# EAGLE schematic motor_driver (EAGLE 7.3.0)
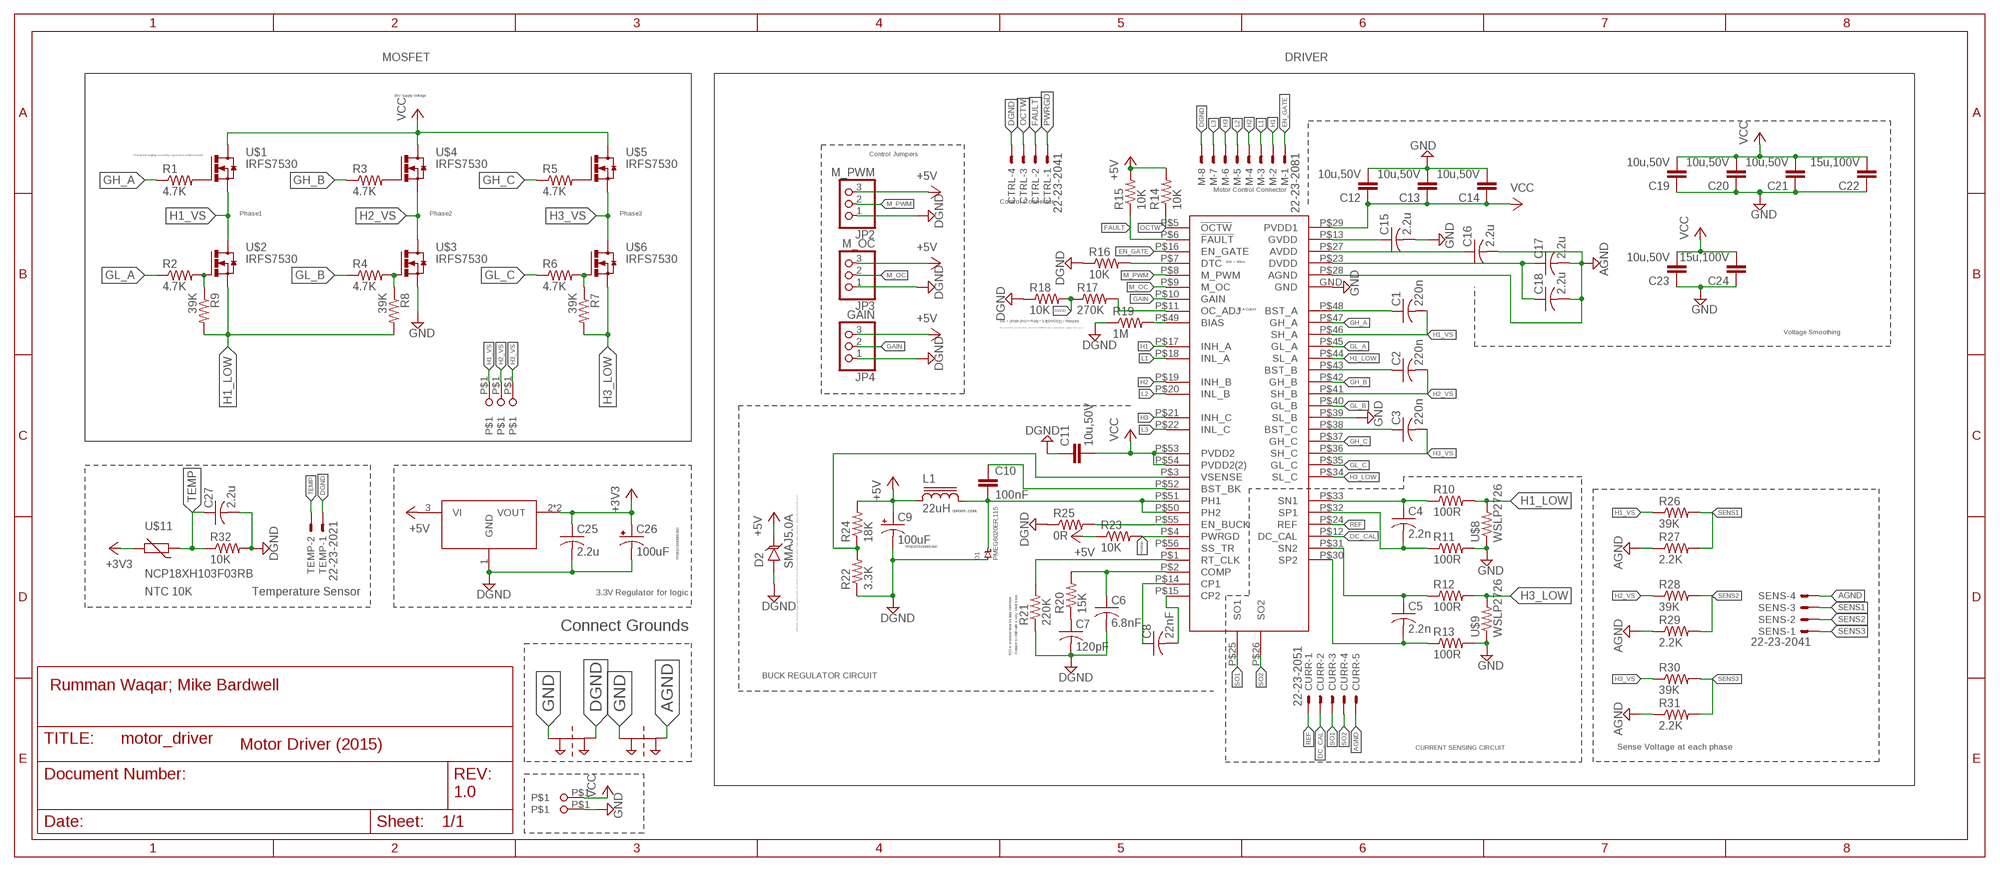
[diagram p0: schematic, sheet 1]

## Parts
C1  220n  C-USC0805  [C0805]
C2  220n  C-USC0805  [C0805]
C3  220n  C-USC0805  [C0805]
C4  2.2n  C-USC0603  [C0603]
C5  2.2n  C-USC0603  [C0603]
C6  6.8nF  C-USC0603  [C0603]
C7  120pF  C-USC0603  [C0603]
C8  22nF  C-USC0603  [C0603]
C9  100uF  CAP_POL3528-KIT  [EIA3528-KIT]
C10  100nF  CAP0805  [0805]
C11  10u,50V  CAP1206  [1206]
C12  10u,50V  CAP1206  [1206]
C13  10u,50V  CAP1206  [1206]
C14  10u,50V  CAP1206  [1206]
C15  2.2u  C-USC0805  [C0805]
C16  2.2u  C-USC0805  [C0805]
C17  2.2u  C-USC0805  [C0805]
C18  2.2u  C-USC0805  [C0805]
C19  10u,50V  CAP1206  [1206]
C20  10u,50V  CAP1206  [1206]
C21  10u,50V  CAP1206  [1206]
C22  15u,100V  C-EUC2220K  [C2220K]
C23  10u,50V  CAP1206  [1206]
C24  15u,100V  C-EUC2220K  [C2220K]
C25  2.2u  C-USC0805  [C0805]
C26  100uF  CAP_POL3528-KIT  [EIA3528-KIT]
C27  2.2u  C-USC0805  [C0805]
CTRL  22-23-2041  [22-23-2041]
CURR  22-23-2051  [22-23-2051]
D1  PMEG6020ER,115  DIODE[SCHOTKY]-SOD123W  [SOD123W]
D2  SMAJ5.0A  TVSSMA  [SMA-DIODE]
JP2  M_PWM  PINHD-1X3  [1X03]
JP3  M_OC  PINHD-1X3  [1X03]
JP4  GAIN  PINHD-1X3  [1X03]
L1  22uH  SDR0805  [SDR0805]
M  22-23-2081  [22-23-2081]
PT1  2PT_GND_TIE  [2PT_GND_TIE]
PT2  2PT_GND_TIE  [2PT_GND_TIE]
R1  4.7K  R-US_R0603  [R0603]
R2  4.7K  R-US_R0603  [R0603]
R3  4.7K  R-US_R0603  [R0603]
R4  4.7K  R-US_R0603  [R0603]
R5  4.7K  R-US_R0603  [R0603]
R6  4.7K  R-US_R0603  [R0603]
R7  39K  R-US_R0603  [R0603]
R8  39K  R-US_R0603  [R0603]
R9  39K  R-US_R0603  [R0603]
R10  100R  R-US_R0603  [R0603]
R11  100R  R-US_R0603  [R0603]
R12  100R  R-US_R0603  [R0603]
R13  100R  R-US_R0603  [R0603]
R14  10K  R-US_R0603  [R0603]
R15  10K  R-US_R0603  [R0603]
R16  10K  R-US_R0603  [R0603]
R17  270K  R-US_R0603  [R0603]
R18  10K  R-US_R0603  [R0603]
R19  1M  R-US_R0603  [R0603]
R20  15K  R-US_R0603  [R0603]
R21  220K  R-US_R0603  [R0603]
R22  3.3K  R-US_R0603  [R0603]
R23  10K  R-US_R0603  [R0603]
R24  18K  R-US_R0603  [R0603]
R25  0R  R-US_R0603  [R0603]
R26  39K  R-US_R0805  [R0805]
R27  2.2K  R-US_R0805  [R0805]
R28  39K  R-US_R0805  [R0805]
R29  2.2K  R-US_R0805  [R0805]
R30  39K  R-US_R0805  [R0805]
R31  2.2K  R-US_R0805  [R0805]
R32  10K  R-US_M0805  [M0805]
SENS  22-23-2041  [22-23-2041]
TEMP  22-23-2021  [22-23-2021]
U$1  IRFS7530  IRFS7530_HEATSINK  [IRF7530_HEATSINK]
U$2  IRFS7530  IRFS7530_HEATSINK  [IRF7530_HEATSINK]
U$3  IRFS7530  IRFS7530_HEATSINK  [IRF7530_HEATSINK]
U$4  IRFS7530  IRFS7530_HEATSINK  [IRF7530_HEATSINK]
U$5  IRFS7530  IRFS7530_HEATSINK  [IRF7530_HEATSINK]
U$6  IRFS7530  IRFS7530_HEATSINK  [IRF7530_HEATSINK]
U$7  DRV8302  [DRV8302]
U$8  WSLP2726  [WSLP2726]
U$9  WSLP2726  [WSLP2726]
U$10  TC2117  [SOT223]
U$11  NCP18XH103F03RB  [R0603]
U$12  1CONN_SOLDER  [1CONN_PAD]
U$13  1CONN_SOLDER  [1CONN_PAD]
U$14  1CONN_SOLDER  [1CONN_PAD]
U$15  1CONN_SOLDER  [1CONN_PAD]
U$16  1CONN_SOLDER  [1CONN_PAD]

## Nets
+3V3: C25.1 C26.A(+) U$10.2(VOUT) U$10.4(VOUT) U$11.2
+5V: C9.A(+) D2.C JP2.3 JP3.3 JP4.3 L1.1 R14.2 R15.2 R23.1 R24.2 U$10.3(VI)
AGND: C16.2 C17.2 C18.2 CURR.5 PT2.P$2 R27.1 R29.1 R31.1 SENS.4 U$7.P$28(AGND)
DC_CAL: CURR.2 U$7.P$12(DC_CAL)
DGND: C6.2 C7.2 C9.C(-) C11.1 C25.2 C26.C(-) C27.2 CTRL.4 D1.P$1 D2.A JP2.1 JP3.1 JP4.1 M.8 PT1.P$2 R16.1 R18.1 R19.1 R21.1 R22.1 R25.1 R32.2 TEMP.1 U$10.1(GND)
DVDD: R17.1 R18.2
EN_GATE: M.1 U$7.P$16(EN_GATE)
FAULT: CTRL.2 R15.1 U$7.P$6(!FAULT)
GAIN: JP4.2 U$7.P$10(GAIN)
GH_A: R1.1 U$7.P$47(GH_A)
GH_B: R3.1 U$7.P$42(GH_B)
GH_C: R5.1 U$7.P$37(GH_C)
GL_A: R2.1 U$7.P$45(GL_A)
GL_B: R4.1 U$7.P$40(GL_B)
GL_C: R6.1 U$7.P$35(GL_C)
GND: C12.2 C13.2 C14.2 C15.2 C19.1 C20.1 C21.1 C22.1 C23.1 C24.1 PT1.P$1 PT2.P$1 R11.2 R13.2 U$3.S1(S) U$3.S2(S) U$3.S3(S) U$3.S4(S) U$3.S5(S) U$7.GND U$7.P$39(SL_B) U$8.P$1@1 U$8.P$1@2 U$9.P$1@1 U$9.P$1@2 U$16.P$1
H1: M.2 U$7.P$17(INH_A)
H1_LOW: R8.2 R9.2 R10.2 U$2.S1(S) U$2.S2(S) U$2.S3(S) U$2.S4(S) U$2.S5(S) U$7.P$44(SL_A) U$8.P$2@1 U$8.P$2@2
H1_VS: C1.2 R26.1 U$1.S1(S) U$1.S2(S) U$1.S3(S) U$1.S4(S) U$1.S5(S) U$2.D1(D) U$7.P$46(SH_A) U$14.P$1
H2: M.4 U$7.P$19(INH_B)
H2_VS: C2.2 R28.1 U$3.D1(D) U$4.S1(S) U$4.S2(S) U$4.S3(S) U$4.S4(S) U$4.S5(S) U$7.P$41(SH_B) U$13.P$1
H3: M.6 U$7.P$21(INH_C)
H3_LOW: R7.2 R12.2 U$6.S1(S) U$6.S2(S) U$6.S3(S) U$6.S4(S) U$6.S5(S) U$7.P$34(SL_C) U$9.P$2@1 U$9.P$2@2
H3_VS: C3.2 R30.1 U$5.S1(S) U$5.S2(S) U$5.S3(S) U$5.S4(S) U$5.S5(S) U$6.D1(D) U$7.P$36(SH_C) U$12.P$1
L1: M.3 U$7.P$18(INL_A)
L2: M.5 U$7.P$20(INL_B)
L3: M.7 U$7.P$22(INL_C)
M_OC: JP3.2 U$7.P$9(M_OC)
M_PWM: JP2.2 U$7.P$8(M_PWM)
N$1: R1.2 U$1.G1(G)
N$2: R2.2 R9.1 U$2.G1(G)
N$3: R4.2 R8.1 U$3.G1(G)
N$4: R3.2 U$4.G1(G)
N$5: R5.2 U$5.G1(G)
N$6: R6.2 R7.1 U$6.G1(G)
N$7: C1.1 U$7.P$48(BST_A)
N$8: R17.2 U$7.P$11(OC_ADJ)
N$10: C8.1 U$7.P$14(CP1)
N$11: C5.2 R13.1 U$7.P$30(SP2)
N$12: C2.1 U$7.P$43(BST_B)
N$13: C8.2 U$7.P$15(CP2)
N$14: C7.1 R20.1
N$15: R21.2 U$7.P$1(RT_CLK)
N$16: R16.2 U$7.P$7(DTC)
N$17: R25.2 U$7.P$55(EN_BUCK)
N$18: C15.1 U$7.P$13(GVDD)
N$19: C10.2 D1.P$2 L1.2 U$7.P$50(PH2) U$7.P$51(PH1)
N$20: C6.1 R20.2 U$7.P$2(COMP)
N$21: R19.2 U$7.P$49(BIAS)
N$22: C4.1 R10.1 U$7.P$33(SN1)
N$23: C4.2 R11.1 U$7.P$32(SP1)
N$24: C5.1 R12.1 U$7.P$31(SN2)
N$26: C3.1 U$7.P$38(BST_C)
N$27: C16.1 U$7.P$27(AVDD)
N$28: R22.2 R24.1 U$7.P$3(VSENSE)
N$29: C10.1 U$7.P$52(BST_BK)
N$30: C17.1 C18.1 U$7.P$23(DVDD)
OCTW: CTRL.3 R14.1 U$7.P$5(!OCTW)
PWRGD: CTRL.1 R23.2 U$7.P$4(PWRGD)
REF: CURR.1 U$7.P$24(REF)
SENS1: R26.2 R27.2 SENS.3
SENS2: R28.2 R29.2 SENS.2
SENS3: R30.2 R31.2 SENS.1
SO1: CURR.3 U$7.P$25(SO1)
SO2: CURR.4 U$7.P$26(SO2)
TEMP: C27.1 R32.1 TEMP.2 U$11.1
VCC: C11.2 C12.1 C13.1 C14.1 C19.2 C20.2 C21.2 C22.2 C23.2 C24.2 U$1.D1(D) U$4.D1(D) U$5.D1(D) U$7.P$29(PVDD1) U$7.P$53(PVDD2) U$7.P$54(PVDD2(2)) U$15.P$1
Unconnected: U$7.P$56(SS_TR)

## Notes on the sheet
- MOSFET | DRIVER
- 36V Supply Voltage
- * Dampens ringing caused by capacitance of the mosfet | Control Jumpers
- Motor Control Connector
- Control Connector
- Phase1 | Phase2 | Phase3
- 10K = 80ns
- 90 A Cutoff
- Ioc = (R18/ (R17+R18) * 3.3[DVDD] ) / Rds(on)
- Don't mount R18, because internal current limit of DRV8302 doesn't work with this config for some reason
- Voltage Smoothing
- SDR0805-220ML
- TPSB107K006R0400
- TPSB107K006R0400
- NTC 10K | Temperature Sensor | 3.3V Regulator for logic
- Connect Grounds | A TVS diode, or transient voltage suppression diode, is an electrical device which is designed to divert or shunt voltage spikes from a circuit in order to protect that circuit.
- R21 is external clock for buck converter. | Connect to GND with a very short trace.
- BUCK REGULATOR CIRCUIT
- Rumman Waqar; Mike Bardwell
- Motor Driver (2015) | CURRENT SENSING CIRCUIT | Sense Voltage at each phase
- 1.0

## Library data of the parts
C1-C8 C15-C18 C25 C27 = adafruit:C-US: CAPACITOR, American symbol
C9 C26 = SparkFun-Capacitors:CAP_POL: Capacitor Polarized These are standard SMD and PTH capacitors. Normally 10uF, 47uF, and 100uF in electrolytic and tantalum varieties. Always verify the external diameter of the through hole cap, it varies with capacity, voltage, and manufacturer. The EIA devices should be standard.
C10-C14 C19-C21 C23 = SparkFun-Passives:CAP: Capacitor Standard 0603 ceramic capacitor, and 0.1" leaded capacitor.
C22 C24 = resistor:C-EU: CAPACITOR, European symbol
CTRL SENS = con-molex:22-23-2041: .100" (2.54mm) Center Header - 4 Pin; MF: MOLEX; MPN: 22-23-2041; OC_FARNELL: 1462920; OC_NEWARK: 38C0355
CURR = con-molex:22-23-2051: .100" (2.54mm) Center Header - 5 Pin; MF: MOLEX; MPN: 22-23-2051; OC_FARNELL: 1462952; OC_NEWARK: 38C9178
D1 = nxp:DIODE[SCHOTKY]
D2 = SparkFun-DiscreteSemi:TVS: Transient voltage suppressor- prevents ESD on inputs.
JP2-JP4 = pinhead:PINHD-1X3: PIN HEADER
L1 = bourne:SDR0805: POWER INDUCTOR
M = con-molex:22-23-2081: .100" (2.54mm) Center Header - 8 Pin; MF: MOLEX; MPN: 22-23-2081; OC_FARNELL: 1756826; OC_NEWARK: 01C7592
PT1 PT2 = SparkFun-Passives:2PT_GND_TIE: Package for connecting two ground nets in one place.
R1-R32 = adafruit:R-US_: RESISTOR, American symbol
TEMP = con-molex:22-23-2021: .100" (2.54mm) Center Header - 2 Pin; MF: MOLEX; MPN: 22-23-2021; OC_FARNELL: 1462926; OC_NEWARK: 25C3832
U$1-U$6 = bldc_lib:IRFS7530_HEATSINK: IRFS7530 with Heatsink
U$7 = bldc_lib:DRV8302: DRV8302 3-Phase Brushless Motor Pre-Driver with Dual Current Sense Amps and Buck Converter (PWM Ctrl)
U$8 U$9 = bldc_lib:WSLP2726: WSLP2726 Power Metal Strip® Resistors, Very High Power (to 7 W), Low Value (down to 0.0003 ), Surface Mount
U$10 = bldc_lib:TC2117
U$11 = bldc_lib:NCP18XH103F03RB: NTC Thermistor NTC Thermistors 10K OHM 1%
U$12-U$16 = bldc_lib:1CONN_SOLDER